# Altium project PCB_Project.PrjPcb
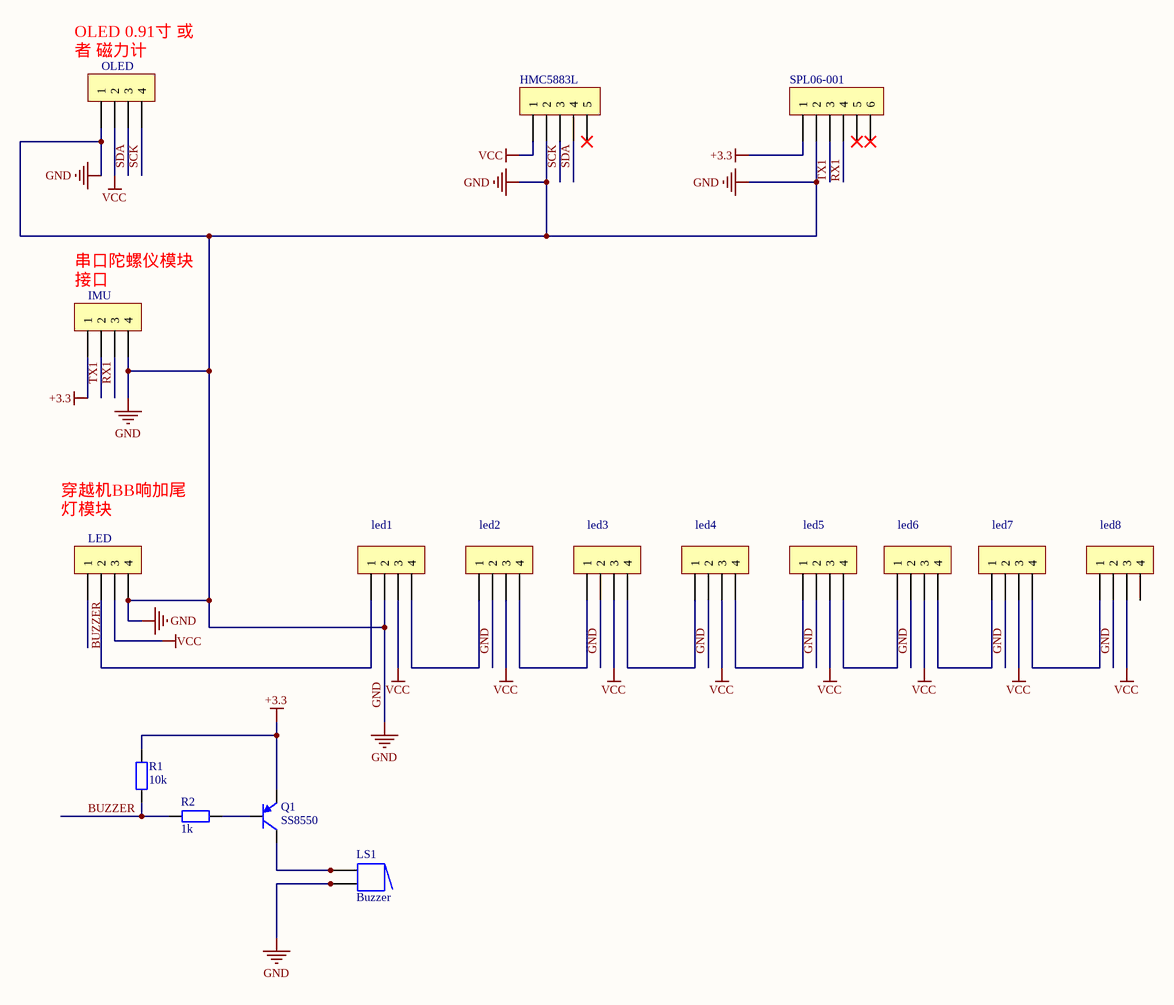
[diagram p0: Sheet1.SchDoc]
1 sheet, 17 parts. Net scope: global (net labels, ports and power ports of the same name join across sheets).
Board file: PCB1.PcbDoc

## Sheet Sheet1.SchDoc
size A3

### Parts
HMC5883L  Pin HDR1X5  [Pin HDR1X5/2.54mm-S]  (value not drawn)
IMU  Female HDR1X4  [SH1.0 S-W-4P]  (value not drawn)
LED  Female HDR1X4  [SH1.0 S-W-4P]  (value not drawn)
led1  Pin HDR1X4  [SH1.0 S-W-4P]  (value not drawn)
led2  Pin HDR1X4  [SH1.0 S-W-4P]  (value not drawn)
led3  Pin HDR1X4  [SH1.0 S-W-4P]  (value not drawn)
led4  Pin HDR1X4  [SH1.0 S-W-4P]  (value not drawn)
led5  Pin HDR1X4  [SH1.0 S-W-4P]  (value not drawn)
led6  Pin HDR1X4  [SH1.0 S-W-4P]  (value not drawn)
led7  Pin HDR1X4  [SH1.0 S-W-4P]  (value not drawn)
led8  Pin HDR1X4  [SH1.0 S-W-4P]  (value not drawn)
LS1  Buzzer  [Buzzer]
OLED  Female HDR1X4  [SH1.0 S-W-4P]  (value not drawn)
Q1  SS8550  [SOT23-3N]
R1  10k  [R 0603_M]
R2  1k  [R 0603_M]
SPL06-001  Pin HDR1X6  [Pin HDR1X6/2.54mm-S]  (value not drawn)

### Nets
+3.3: IMU.1 Q1.2(E) R1.2 SPL06-001.1
GND: HMC5883L.2 IMU.4 LED.4 led1.2 led2.2 led3.2 led4.2 led5.2 led6.2 led7.2 led8.2 LS1.2 LS1.2A OLED.1 SPL06-001.2
VCC: HMC5883L.1 LED.3 led1.3 led2.3 led3.3 led4.3 led5.3 led6.3 led7.3 led8.3 OLED.2
BUZZER: LED.1 R1.1 R2.2
RX1: IMU.3 SPL06-001.4
SCK: HMC5883L.3 OLED.4
SDA: HMC5883L.4 OLED.3
TX1: IMU.2 SPL06-001.3
Netled1_4: led1.4 led2.1
Netled2_4: led2.4 led3.1
Netled3_4: led3.4 led4.1
Netled4_4: led4.4 led5.1
Netled5_4: led5.4 led6.1
Netled6_4: led6.4 led7.1
Netled7_4: led7.4 led8.1
NetLED_2: LED.2 led1.1
NetLS1_1: LS1.1 LS1.1A Q1.3(C)
NetQ1_1: Q1.1(B) R2.1

Not connected (* = marked no-connect by the designer): HMC5883L 5*; led8 4; SPL06-001 5* 6*

### Notes on the sheet
- (near OLED) OLED 0.91寸 或者 磁力计
- (near IMU) 串口陀螺仪模块接口
- 穿越机BB响加尾灯模块

### Library data of the parts
LS1 = Buzzer: Magnetic Transducer Buzzer; pin to pad: 1A>1 2A>2; Published: 24-Mar-1999; LatestRevisionDate: 17-Dec-2003; LatestRevisionNote: Schematic revised, PCB Footprint replaced.; DatasheetVersion: 17-Dec-2003; PackageReference: ABSM-1574; Publisher: Altium Limited; PackageDescription: Magnetic Transducer Buzzer; ComponentLink1Description: Manufacturer Link; ComponentLink1URL: http://www.megastar.com/linecard/buzzmode/index.php
Q1 = 9012-SMD: 低频放大-PNP型; 版权归属: 源创客; 属性: 50V 0.5A 0.625W; BOM名称: 低频放大-PNP型; 学习资源: www.ooocke.com
R1 R2 = R: 贴片电阻; 版权归属: 源创客; BOM名称: 贴片电阻; 学习资源: www.ooocke.com